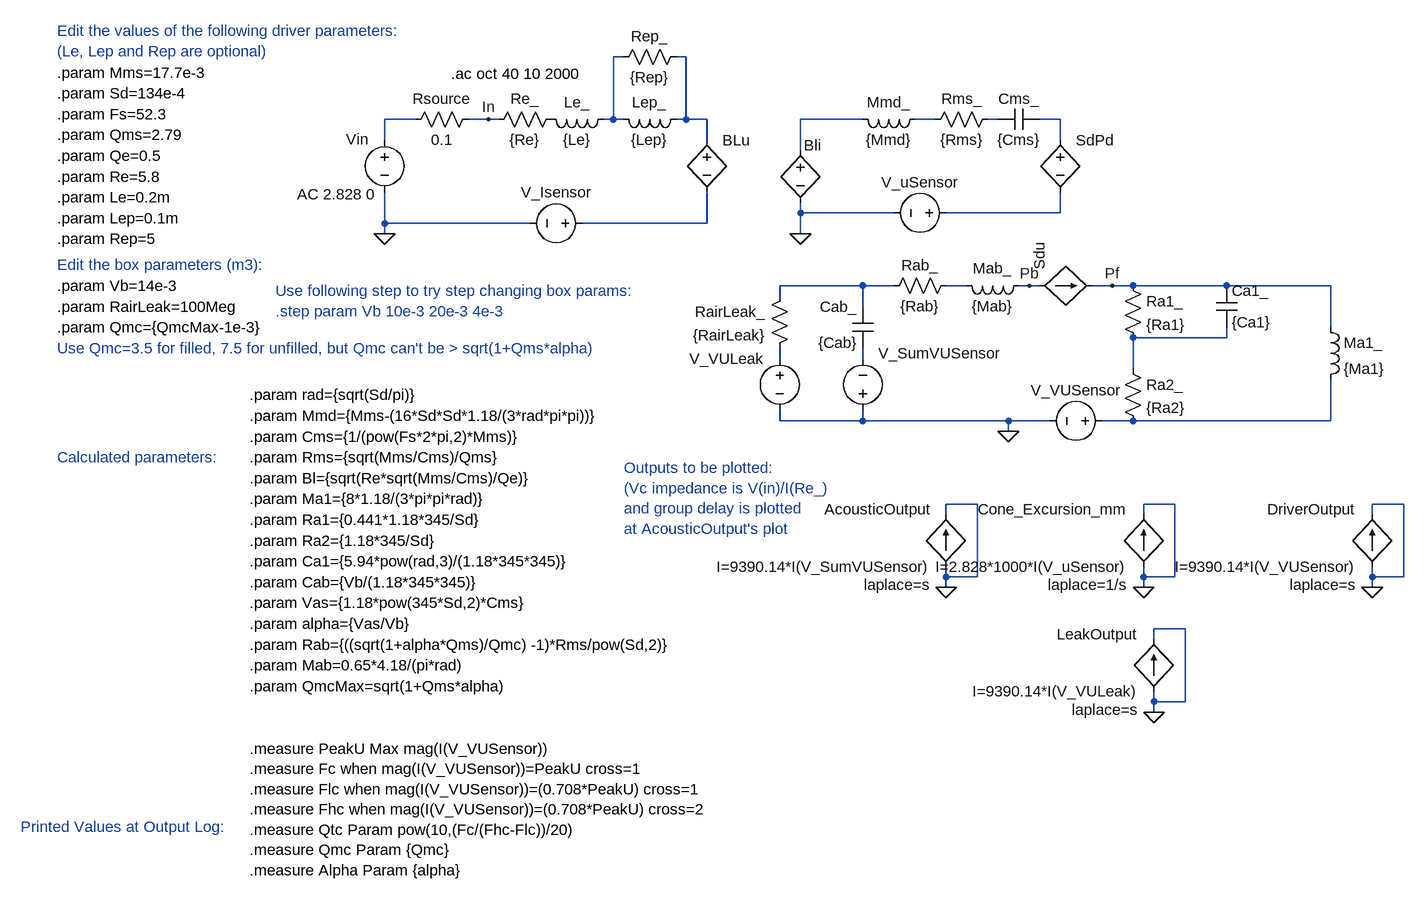
[diagram p0: schematic ClosedBox.asc]
ClosedBox.asc, the LTspice schematic file:
Version 4
SHEET 1 880 680
WIRE -1712 -640 -1712 -672
WIRE -1712 -512 -1712 -560
WIRE -1712 -496 -1712 -512
WIRE -1664 -672 -1712 -672
WIRE -1552 -672 -1584 -672
WIRE -1536 -672 -1552 -672
WIRE -1488 -512 -1712 -512
WIRE -1360 -672 -1376 -672
WIRE -1360 -672 -1360 -768
WIRE -1344 -768 -1360 -768
WIRE -1344 -672 -1360 -672
WIRE -1248 -768 -1264 -768
WIRE -1248 -672 -1264 -672
WIRE -1248 -672 -1248 -768
WIRE -1216 -672 -1248 -672
WIRE -1216 -640 -1216 -672
WIRE -1216 -512 -1408 -512
WIRE -1216 -512 -1216 -560
WIRE -1104 -400 -1104 -416
WIRE -1104 -304 -1104 -320
WIRE -1104 -208 -1104 -224
WIRE -1072 -624 -1072 -672
WIRE -1072 -528 -1072 -544
WIRE -1072 -496 -1072 -528
WIRE -976 -672 -1072 -672
WIRE -976 -416 -1104 -416
WIRE -976 -384 -976 -416
WIRE -976 -304 -976 -320
WIRE -976 -208 -1104 -208
WIRE -976 -208 -976 -224
WIRE -928 -528 -1072 -528
WIRE -928 -416 -976 -416
WIRE -864 -672 -896 -672
WIRE -848 -64 -848 -80
WIRE -848 32 -848 16
WIRE -848 48 -848 32
WIRE -816 -416 -848 -416
WIRE -800 -80 -848 -80
WIRE -800 32 -848 32
WIRE -800 32 -800 -80
WIRE -768 -672 -784 -672
WIRE -752 -208 -976 -208
WIRE -752 -192 -752 -208
WIRE -720 -416 -736 -416
WIRE -704 -416 -720 -416
WIRE -688 -208 -752 -208
WIRE -672 -672 -704 -672
WIRE -672 -640 -672 -672
WIRE -672 -528 -848 -528
WIRE -672 -528 -672 -560
WIRE -592 -416 -624 -416
WIRE -560 -416 -592 -416
WIRE -560 -288 -560 -336
WIRE -560 -208 -608 -208
WIRE -544 -64 -544 -80
WIRE -544 32 -544 16
WIRE -544 48 -544 32
WIRE -528 128 -528 112
WIRE -528 224 -528 208
WIRE -528 240 -528 224
WIRE -496 -80 -544 -80
WIRE -496 32 -544 32
WIRE -496 32 -496 -80
WIRE -480 112 -528 112
WIRE -480 224 -528 224
WIRE -480 224 -480 112
WIRE -416 -416 -560 -416
WIRE -416 -336 -560 -336
WIRE -416 -336 -416 -352
WIRE -256 -416 -416 -416
WIRE -256 -352 -256 -416
WIRE -256 -208 -560 -208
WIRE -256 -208 -256 -272
WIRE -192 -64 -192 -80
WIRE -192 32 -192 16
WIRE -192 48 -192 32
WIRE -144 -80 -192 -80
WIRE -144 32 -192 32
WIRE -144 32 -144 -80
FLAG -1712 -496 0
FLAG -1072 -496 0
FLAG -752 -192 0
FLAG -592 -416 Pf
FLAG -1552 -672 In
FLAG -848 48 0
FLAG -544 48 0
FLAG -720 -416 Pb
FLAG -192 48 0
FLAG -528 240 0
SYMBOL voltage -1712 -656 R0
WINDOW 3 24 44 Left 0
WINDOW 123 -135 99 Left 0
WINDOW 39 0 0 Left 0
WINDOW 0 -59 15 Left 0
SYMATTR Value ""
SYMATTR Value2 AC 2.828 0
SYMATTR InstName Vin
SYMBOL res -1440 -688 R90
WINDOW 0 0 56 VBottom 0
WINDOW 3 32 56 VTop 0
SYMATTR InstName Re_
SYMATTR Value {Re}
SYMBOL ind -1360 -688 R90
WINDOW 0 5 56 VBottom 0
WINDOW 3 32 56 VTop 0
SYMATTR InstName Le_
SYMATTR Value {Le}
SYMBOL voltage -1392 -512 R90
WINDOW 0 -32 56 VBottom 0
WINDOW 3 32 56 VTop 0
WINDOW 39 0 0 Left 0
SYMATTR InstName V_Isensor
SYMATTR Value ""
SYMATTR Value2 AC 0
SYMBOL h -1216 -656 R0
WINDOW 3 24 44 Invisible 0
SYMATTR Value V_uSensor
SYMATTR InstName BLu
SYMATTR Value2 {Bl}
SYMBOL h -1072 -640 R0
WINDOW 0 5 8 Left 0
WINDOW 3 24 104 Invisible 0
SYMATTR InstName Bli
SYMATTR Value V_ISensor
SYMATTR Value2 {BL}
SYMBOL ind -880 -688 R90
WINDOW 0 5 56 VBottom 0
WINDOW 3 32 56 VTop 0
SYMATTR InstName Mmd_
SYMATTR Value {Mmd}
SYMBOL res -768 -688 R90
WINDOW 0 0 56 VBottom 0
WINDOW 3 32 56 VTop 0
SYMATTR InstName Rms_
SYMATTR Value {Rms}
SYMBOL cap -704 -688 R90
WINDOW 0 0 32 VBottom 0
WINDOW 3 32 32 VTop 0
SYMATTR InstName Cms_
SYMATTR Value {Cms}
SYMBOL h -672 -656 R0
WINDOW 3 24 104 Invisible 0
SYMATTR Value Pf
SYMATTR InstName SdPd
SYMATTR Prefix E
SYMATTR Value2 Pb
SYMATTR SpiceLine {Sd}
SYMBOL voltage -832 -528 R90
WINDOW 0 -32 56 VBottom 0
WINDOW 3 32 56 VTop 0
WINDOW 39 0 0 Left 0
SYMATTR InstName V_uSensor
SYMATTR Value ""
SYMATTR Value2 AC 0
SYMBOL f -704 -416 R270
WINDOW 3 24 88 Invisible 0
SYMATTR Value V_uSensor
SYMATTR InstName Sdu
SYMATTR Value2 {Sd}
SYMBOL res -576 -432 R0
SYMATTR InstName Ra1_
SYMATTR Value {Ra1}
SYMBOL res -576 -304 R0
SYMATTR InstName Ra2_
SYMATTR Value {Ra2}
SYMBOL cap -432 -416 R0
SYMATTR InstName Ca1_
SYMATTR Value {Ca1}
SYMBOL ind -272 -368 R0
SYMATTR InstName Ma1_
SYMATTR Value {Ma1}
SYMBOL ind -1248 -688 R90
WINDOW 0 5 56 VBottom 0
WINDOW 3 32 56 VTop 0
SYMATTR InstName Lep_
SYMATTR Value {Lep}
SYMBOL res -1360 -752 R270
WINDOW 0 32 56 VTop 0
WINDOW 3 0 56 VBottom 0
SYMATTR InstName Rep_
SYMATTR Value {Rep}
SYMBOL res -1680 -656 R270
WINDOW 0 32 56 VTop 0
WINDOW 3 0 56 VBottom 0
SYMATTR InstName Rsource
SYMATTR Value 0.1
SYMBOL voltage -592 -208 R90
WINDOW 0 -32 56 VBottom 0
WINDOW 3 32 56 VTop 0
WINDOW 39 0 0 Left 0
SYMATTR InstName V_VUSensor
SYMATTR Value ""
SYMATTR Value2 AC 0
SYMBOL bi -848 16 R180
WINDOW 0 24 88 Left 0
WINDOW 3 24 0 Left 0
WINDOW 39 24 -28 Left 0
SYMATTR InstName AcousticOutput
SYMATTR Value I=9390.14*I(V_SumVUSensor)
SYMATTR SpiceLine laplace=s
SYMBOL bi -544 16 R180
WINDOW 0 24 88 Left 0
WINDOW 3 24 0 Left 0
WINDOW 39 24 -28 Left 0
SYMATTR InstName Cone_Excursion_mm
SYMATTR Value I=2.828*1000*I(V_uSensor)
SYMATTR SpiceLine laplace=1/s
SYMBOL ind -720 -432 R90
WINDOW 0 5 56 VBottom 0
WINDOW 3 32 56 VTop 0
SYMATTR InstName Mab_
SYMATTR Value {Mab}
SYMBOL res -832 -432 R90
WINDOW 0 0 56 VBottom 0
WINDOW 3 32 56 VTop 0
SYMATTR InstName Rab_
SYMATTR Value {Rab}
SYMBOL cap -960 -320 R180
WINDOW 0 24 64 Left 0
WINDOW 3 24 8 Left 0
SYMATTR InstName Cab_
SYMATTR Value {Cab}
SYMBOL res -1088 -416 M0
SYMATTR InstName RairLeak_
SYMATTR Value {RairLeak}
SYMBOL voltage -1104 -320 M0
WINDOW 39 0 0 Left 0
SYMATTR Value2 AC 0
SYMATTR InstName V_VULeak
SYMATTR Value ""
SYMBOL voltage -976 -208 M180
WINDOW 0 24 104 Left 0
WINDOW 3 24 16 Left 0
WINDOW 39 0 0 Left 0
SYMATTR InstName V_SumVUSensor
SYMATTR Value ""
SYMATTR Value2 AC 0
SYMBOL bi -192 16 R180
WINDOW 0 24 88 Left 0
WINDOW 3 24 0 Left 0
WINDOW 39 24 -28 Left 0
SYMATTR InstName DriverOutput
SYMATTR Value I=9390.14*I(V_VUSensor)
SYMATTR SpiceLine laplace=s
SYMBOL bi -528 208 R180
WINDOW 0 24 88 Left 0
WINDOW 3 24 0 Left 0
WINDOW 39 24 -28 Left 0
SYMATTR InstName LeakOutput
SYMATTR Value I=9390.14*I(V_VULeak)
SYMATTR SpiceLine laplace=s
TEXT -1610 -742 Left 0 !.ac oct 40 10 2000
TEXT -1920 -120 Left 0 !.param Bl={sqrt(Re*sqrt(Mms/Cms)/Qe)}
TEXT -2216 -744 Left 0 !.param Mms=17.7e-3
TEXT -1920 -216 Left 0 !.param Mmd={Mms-(16*Sd*Sd*1.18/(3*rad*pi*pi))}
TEXT -2216 -712 Left 0 !.param Sd=134e-4
TEXT -1920 -248 Left 0 !.param rad={sqrt(Sd/pi)}
TEXT -2216 -680 Left 0 !.param Fs=52.3
TEXT -1920 -152 Left 0 !.param Rms={sqrt(Mms/Cms)/Qms}
TEXT -1920 -184 Left 0 !.param Cms={1/(pow(Fs*2*pi,2)*Mms)}
TEXT -2216 -648 Left 0 !.param Qms=2.79
TEXT -2216 -616 Left 0 !.param Qe=0.5
TEXT -2216 -584 Left 0 !.param Re=5.8
TEXT -2216 -552 Left 0 !.param Le=0.2m
TEXT -2216 -520 Left 0 !.param Lep=0.1m
TEXT -2216 -488 Left 0 !.param Rep=5
TEXT -1920 -88 Left 0 !.param Ma1={8*1.18/(3*pi*pi*rad)}
TEXT -1920 -56 Left 0 !.param Ra1={0.441*1.18*345/Sd}
TEXT -1920 -24 Left 0 !.param Ra2={1.18*345/Sd}
TEXT -1920 8 Left 0 !.param Ca1={5.94*pow(rad,3)/(1.18*345*345)}
TEXT -2216 -152 Left 0 ;Calculated parameters:
TEXT -2216 -808 Left 0 ;Edit the values of the following driver parameters:\n(Le, Lep and Rep are optional)
TEXT -1344 -136 Left 0 ;Outputs to be plotted:\n(Vc impedance is V(in)/I(Re_)\nand group delay is plotted\nat AcousticOutput's plot
TEXT -2216 -448 Left 0 ;Edit the box parameters (m3):
TEXT -2216 -416 Left 0 !.param Vb=14e-3
TEXT -1920 40 Left 0 !.param Cab={Vb/(1.18*345*345)}
TEXT -2216 -384 Left 0 !.param RairLeak=100Meg
TEXT -2216 -352 Left 0 !.param Qmc={QmcMax-1e-3}
TEXT -2216 -320 Left 0 ;Use Qmc=3.5 for filled, 7.5 for unfilled, but Qmc can't be > sqrt(1+Qms*alpha)
TEXT -1920 72 Left 0 !.param Vas={1.18*pow(345*Sd,2)*Cms}
TEXT -1920 200 Left 0 !.param QmcMax=sqrt(1+Qms*alpha)
TEXT -1920 104 Left 0 !.param alpha={Vas/Vb}
TEXT -1920 136 Left 0 !.param Rab={((sqrt(1+alpha*Qms)/Qmc) -1)*Rms/pow(Sd,2)}
TEXT -1920 168 Left 0 !.param Mab=0.65*4.18/(pi*rad)
TEXT -1880 -408 Left 0 ;Use following step to try step changing box params:\n.step param Vb 10e-3 20e-3 4e-3
TEXT -1920 296 Left 0 !.measure PeakU Max mag(I(V_VUSensor))\n.measure Fc when mag(I(V_VUSensor))=PeakU cross=1\n.measure Flc when mag(I(V_VUSensor))=(0.708*PeakU) cross=1\n.measure Fhc when mag(I(V_VUSensor))=(0.708*PeakU) cross=2\n.measure Qtc Param pow(10,(Fc/(Fhc-Flc))/20)\n.measure Qmc Param {Qmc}\n.measure Alpha Param {alpha}
TEXT -2272 416 Left 0 ;Printed Values at Output Log:

The netlist it stands for:
* ClosedBox.asc
Vin N001 0 AC 2.828 0
Re_ P001 In {Re}
Le_ N002 P001 {Le}
V_Isensor N004 0 AC 0
H§BLu N003 N004 V_uSensor {Bl}
H§Bli N007 0 V_ISensor {BL}
L§Mmd_ N009 N007 {Mmd}
Rms_ N011 N009 {Rms}
Cms_ N012 N011 {Cms}
E§SdPd N012 N013 Pf Pb {Sd}
V_uSensor N013 0 AC 0
F§Sdu Pb Pf V_uSensor {Sd}
Ra1_ Pf N014 {Ra1}
Ra2_ N014 N015 {Ra2}
Ca1_ Pf N014 {Ca1}
L§Ma1_ Pf N015 {Ma1}
Lep_ N003 N002 {Lep}
Rep_ N002 N003 {Rep}
Rsource N001 In 0.1
V_VUSensor N015 0 AC 0
B§AcousticOutput 0 0 I=9390.14*I(V_SumVUSensor) laplace=s
B§Cone_Excursion_mm 0 0 I=2.828*1000*I(V_uSensor) laplace=1/s
L§Mab_ Pb N010 {Mab}
Rab_ N010 N005 {Rab}
Cab_ N008 N005 {Cab}
RairLeak_ N005 N006 {RairLeak}
V_VULeak N006 0 AC 0
V_SumVUSensor 0 N008 AC 0
B§DriverOutput 0 0 I=9390.14*I(V_VUSensor) laplace=s
B§LeakOutput 0 0 I=9390.14*I(V_VULeak) laplace=s
.ac oct 40 10 2000
.param Bl={sqrt(Re*sqrt(Mms/Cms)/Qe)}
.param Mms=17.7e-3
.param Mmd={Mms-(16*Sd*Sd*1.18/(3*rad*pi*pi))}
.param Sd=134e-4
.param rad={sqrt(Sd/pi)}
.param Fs=52.3
.param Rms={sqrt(Mms/Cms)/Qms}
.param Cms={1/(pow(Fs*2*pi,2)*Mms)}
.param Qms=2.79
.param Qe=0.5
.param Re=5.8
.param Le=0.2m
.param Lep=0.1m
.param Rep=5
.param Ma1={8*1.18/(3*pi*pi*rad)}
.param Ra1={0.441*1.18*345/Sd}
.param Ra2={1.18*345/Sd}
.param Ca1={5.94*pow(rad,3)/(1.18*345*345)}
* Calculated parameters:
* Edit the values of the following driver parameters:
* (Le, Lep and Rep are optional)
* Outputs to be plotted:
* (Vc impedance is V(in)/I(Re_)
* and group delay is plotted
* at AcousticOutput's plot
* Edit the box parameters (m3):
.param Vb=14e-3
.param Cab={Vb/(1.18*345*345)}
.param RairLeak=100Meg
.param Qmc={QmcMax-1e-3}
* Use Qmc=3.5 for filled, 7.5 for unfilled, but Qmc can't be > sqrt(1+Qms*alpha)
.param Vas={1.18*pow(345*Sd,2)*Cms}
.param QmcMax=sqrt(1+Qms*alpha)
.param alpha={Vas/Vb}
.param Rab={((sqrt(1+alpha*Qms)/Qmc) -1)*Rms/pow(Sd,2)}
.param Mab=0.65*4.18/(pi*rad)
* Use following step to try step changing box params:
* .step param Vb 10e-3 20e-3 4e-3
.measure PeakU Max mag(I(V_VUSensor))
.measure Fc when mag(I(V_VUSensor))=PeakU cross=1
.measure Flc when mag(I(V_VUSensor))=(0.708*PeakU) cross=1
.measure Fhc when mag(I(V_VUSensor))=(0.708*PeakU) cross=2
.measure Qtc Param pow(10,(Fc/(Fhc-Flc))/20)
.measure Qmc Param {Qmc}
.measure Alpha Param {alpha}
* Printed Values at Output Log:
.backanno
.end